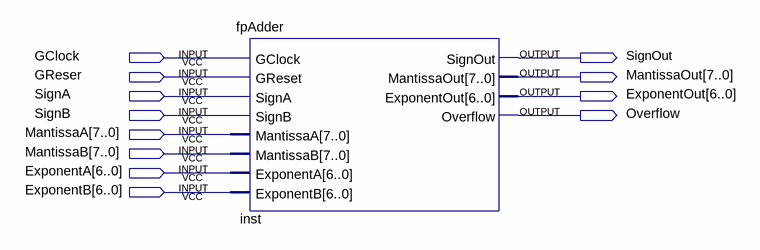
[diagram p0: schematic sheet]
// Quartus schematic fpadderblock.bdf as structural Verilog: 1 symbols, 12 pins
module fpadderblock (
  input  GClock,
  input  GReser,
  input  SignA,
  input  SignB,
  input  [7:0] MantissaA,
  input  [7:0] MantissaB,
  input  [6:0] ExponentA,
  input  [6:0] ExponentB,
  output SignOut,
  output [7:0] MantissaOut,
  output [6:0] ExponentOut,
  output Overflow
);

  fpAdder inst (
    .GClock(GClock), .GReset(GReser), .SignA(SignA), .SignB(SignB), .MantissaA(MantissaA),
    .MantissaB(MantissaB), .ExponentA(ExponentA), .ExponentB(ExponentB), .SignOut(SignOut),
    .MantissaOut(MantissaOut), .ExponentOut(ExponentOut), .Overflow(Overflow));
endmodule
